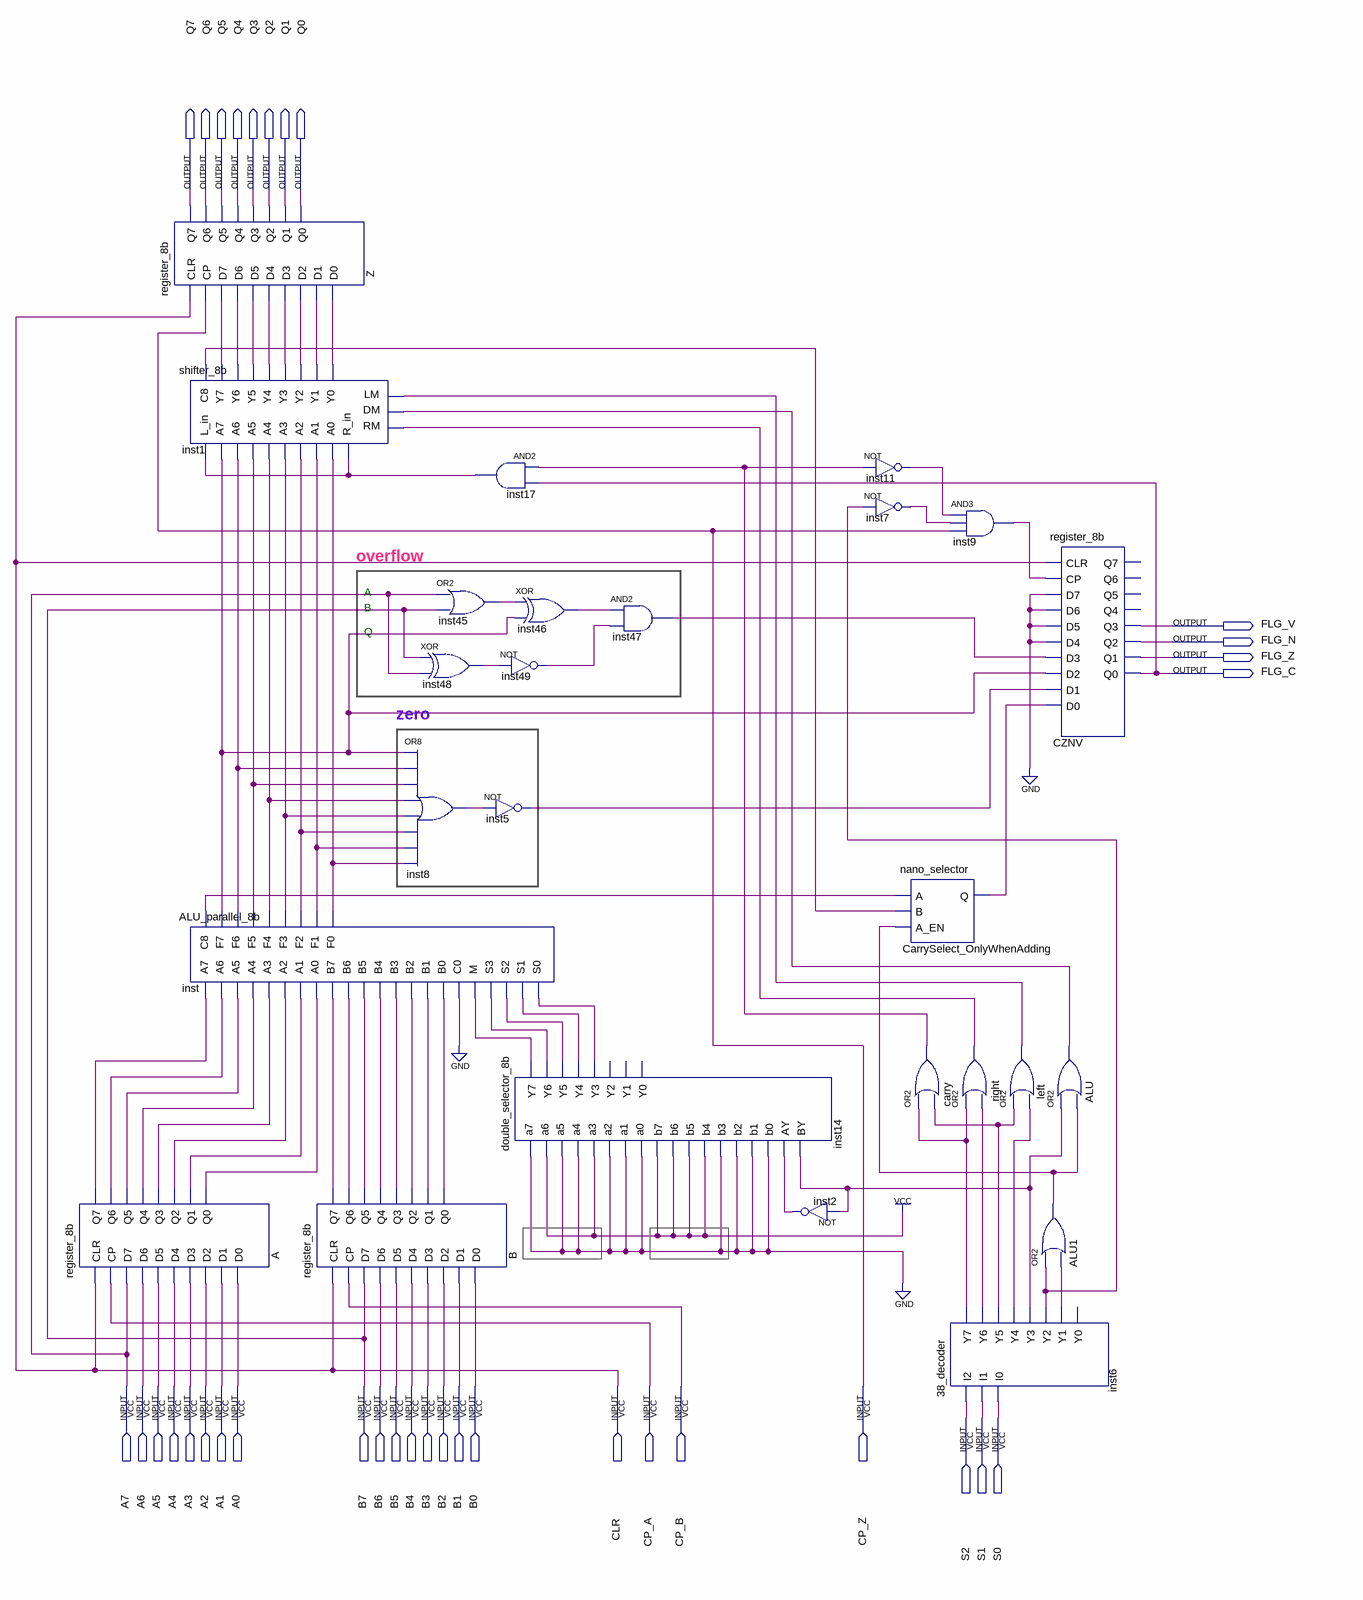
[diagram p0: schematic sheet]
// Quartus schematic ALU_3_in_1.bdf as structural Verilog: 26 symbols, 35 pins
module ALU_3_in_1 (
  input  A7,
  input  A6,
  input  A5,
  input  A4,
  input  A3,
  input  A2,
  input  A1,
  input  A0,
  input  B7,
  input  B6,
  input  B5,
  input  B4,
  input  B3,
  input  B2,
  input  B1,
  input  B0,
  input  CLR,
  input  CP_A,
  input  CP_B,
  input  CP_Z,
  input  S2,
  input  S1,
  input  S0,
  output Q7,
  output Q6,
  output Q5,
  output Q4,
  output Q3,
  output Q2,
  output Q1,
  output Q0,
  output FLG_V,
  output FLG_N,
  output FLG_Z,
  output FLG_C
);

  wire A_q0, A_q1, A_q2, A_q3, A_q4, A_q5, A_q6, A_q7, ALU1_out, ALU_out, B_q0, B_q1, B_q2, B_q3, B_q4, B_q5,
       B_q6, B_q7, carry_out, CarrySelect_OnlyWhenAdding_q, inst1_c8, inst1_y0, inst1_y1, inst1_y2, inst1_y3,
       inst1_y4, inst1_y5, inst1_y6, inst1_y7, inst2_out, inst5_out, inst6_y1, inst6_y2, inst6_y3, inst6_y4,
       inst6_y5, inst6_y6, inst6_y7, inst7_out, inst8_out, inst9_out, inst11_out, inst14_y3, inst14_y4,
       inst14_y5, inst14_y6, inst14_y7, inst17_out, inst45_out, inst46_out, inst47_out, inst48_out,
       inst49_out, inst_c8, inst_f0, inst_f1, inst_f2, inst_f3, inst_f4, inst_f5, inst_f6, inst_f7, left_out,
       right_out;

  register_8b A (
    .CLR(CLR), .CP(CP_A), .D7(A7), .D6(A6), .D5(A5), .D4(A4), .D3(A3), .D2(A2), .D1(A1), .D0(A0), .Q7(A_q7),
    .Q6(A_q6), .Q5(A_q5), .Q4(A_q4), .Q3(A_q3), .Q2(A_q2), .Q1(A_q1), .Q0(A_q0));
  register_8b Z (
    .CLR(CLR), .CP(CP_Z), .D7(inst1_y7), .D6(inst1_y6), .D5(inst1_y5), .D4(inst1_y4), .D3(inst1_y3),
    .D2(inst1_y2), .D1(inst1_y1), .D0(inst1_y0), .Q7(Q7), .Q6(Q6), .Q5(Q5), .Q4(Q4), .Q3(Q3), .Q2(Q2),
    .Q1(Q1), .Q0(Q0));
  shifter_8b inst1 (
    .A7(inst_f7), .A6(inst_f6), .A5(inst_f5), .A4(inst_f4), .A3(inst_f3), .A2(inst_f2), .A1(inst_f1),
    .A0(inst_f0), .LM(left_out), .DM(ALU_out), .RM(right_out), .R_in(inst17_out), .L_in(inst17_out),
    .Y7(inst1_y7), .Y6(inst1_y6), .Y5(inst1_y5), .Y4(inst1_y4), .Y3(inst1_y3), .Y2(inst1_y2), .Y1(inst1_y1),
    .Y0(inst1_y0), .C8(inst1_c8));
  ALU_parallel_8b inst (
    .A0(A_q0), .B0(B_q0), .A1(A_q1), .B1(B_q1), .A2(A_q2), .B2(B_q2), .A3(A_q3), .B3(B_q3), .C0(1'b0),
    .M(inst14_y7), .S3(inst14_y6), .S2(inst14_y5), .S1(inst14_y4), .S0(inst14_y3), .A4(A_q4), .B4(B_q4),
    .A5(A_q5), .B5(B_q5), .A6(A_q6), .B6(B_q6), .A7(A_q7), .B7(B_q7), .F0(inst_f0), .F1(inst_f1),
    .F2(inst_f2), .F3(inst_f3), .C8(inst_c8), .F4(inst_f4), .F5(inst_f5), .F6(inst_f6), .F7(inst_f7));
  register_8b B (
    .CLR(CLR), .CP(CP_B), .D7(B7), .D6(B6), .D5(B5), .D4(B4), .D3(B3), .D2(B2), .D1(B1), .D0(B0), .Q7(B_q7),
    .Q6(B_q6), .Q5(B_q5), .Q4(B_q4), .Q3(B_q3), .Q2(B_q2), .Q1(B_q1), .Q0(B_q0));
  or inst45 (inst45_out, A7, B7);
  xor inst48 (inst48_out, B7, A7);
  or inst8 (inst8_out, inst_f7, inst_f6, inst_f5, inst_f4, inst_f3, inst_f2, inst_f1, inst_f0);
  and inst17 (inst17_out, carry_out, FLG_C);
  not inst49 (inst49_out, inst48_out);
  not inst5 (inst5_out, inst8_out);
  double_selector_8b inst14 (
    .a0(1'b0), .a1(1'b0), .a2(1'b0), .a3(1'b1), .a4(1'b0), .a5(1'b0), .a6(1'b1), .a7(1'b0), .b0(1'b0),
    .b1(1'b0), .b2(1'b0), .b3(1'b0), .b4(1'b1), .b5(1'b1), .b6(1'b1), .b7(1'b1), .AY(inst2_out),
    .BY(inst6_y3), .Y3(inst14_y3), .Y4(inst14_y4), .Y5(inst14_y5), .Y6(inst14_y6), .Y7(inst14_y7));  // open: Y0, Y1, Y2
  xor inst46 (inst46_out, inst45_out, inst_f7);
  and inst47 (inst47_out, inst46_out, inst49_out);
  not inst2 (inst2_out, inst6_y3);
  not inst11 (inst11_out, carry_out);
  not inst7 (inst7_out, inst6_y2);
  and inst9 (inst9_out, inst11_out, inst7_out, CP_Z);
  nano_selector CarrySelect_OnlyWhenAdding (
    .A(inst_c8), .B(inst1_c8), .A_EN(ALU1_out), .Q(CarrySelect_OnlyWhenAdding_q));
  or right (right_out, inst6_y7, inst6_y6);
  or carry (carry_out, inst6_y7, inst6_y5);
  \38_decoder  inst6 (
    .I2(S2), .I1(S1), .I0(S0), .Y7(inst6_y7), .Y6(inst6_y6), .Y5(inst6_y5), .Y4(inst6_y4), .Y3(inst6_y3),
    .Y2(inst6_y2), .Y1(inst6_y1));  // open: Y0
  or left (left_out, inst6_y5, inst6_y4);
  register_8b CZNV (
    .CLR(CLR), .CP(inst9_out), .D7(1'b0), .D6(1'b0), .D5(1'b0), .D4(1'b0), .D3(inst47_out), .D2(inst_f7),
    .D1(inst5_out), .D0(CarrySelect_OnlyWhenAdding_q), .Q3(FLG_V), .Q2(FLG_N), .Q1(FLG_Z), .Q0(FLG_C));  // open: Q7, Q6, Q5, Q4
  or ALU (ALU_out, inst6_y3, ALU1_out);
  or ALU1 (ALU1_out, inst6_y2, inst6_y1);

  // Notes on the sheet:
  //   overflow
  //   A
  //   B
  //   Q
  //   zero
endmodule
